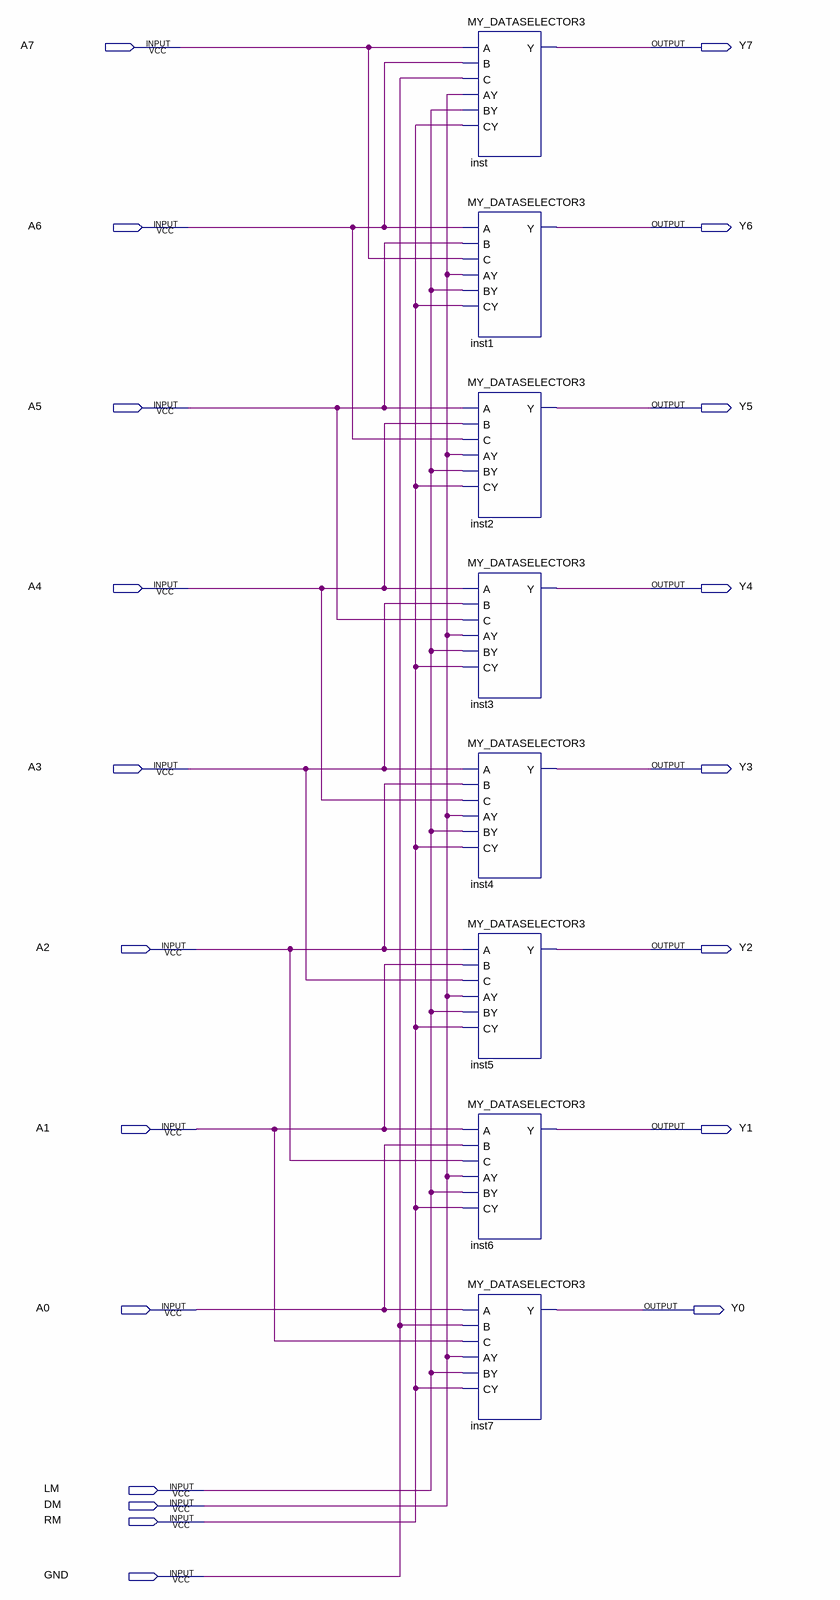
[diagram p0: schematic sheet]
// Quartus schematic MY_SHIFTER.bdf as structural Verilog: 8 symbols, 20 pins
module MY_SHIFTER (
  input  A7,
  input  A6,
  input  A5,
  input  A4,
  input  A3,
  input  A2,
  input  A1,
  input  A0,
  input  LM,
  input  DM,
  input  RM,
  input  GND,
  output Y7,
  output Y6,
  output Y5,
  output Y4,
  output Y3,
  output Y2,
  output Y1,
  output Y0
);

  MY_DATASELECTOR3 inst (.A(A7), .B(A6), .C(GND), .AY(DM), .BY(LM), .CY(RM), .Y(Y7));
  MY_DATASELECTOR3 inst1 (.A(A6), .B(A5), .C(A7), .AY(DM), .BY(LM), .CY(RM), .Y(Y6));
  MY_DATASELECTOR3 inst2 (.A(A5), .B(A4), .C(A6), .AY(DM), .BY(LM), .CY(RM), .Y(Y5));
  MY_DATASELECTOR3 inst3 (.A(A4), .B(A3), .C(A5), .AY(DM), .BY(LM), .CY(RM), .Y(Y4));
  MY_DATASELECTOR3 inst4 (.A(A3), .B(A2), .C(A4), .AY(DM), .BY(LM), .CY(RM), .Y(Y3));
  MY_DATASELECTOR3 inst5 (.A(A2), .B(A1), .C(A3), .AY(DM), .BY(LM), .CY(RM), .Y(Y2));
  MY_DATASELECTOR3 inst6 (.A(A1), .B(A0), .C(A2), .AY(DM), .BY(LM), .CY(RM), .Y(Y1));
  MY_DATASELECTOR3 inst7 (.A(A0), .B(GND), .C(A1), .AY(DM), .BY(LM), .CY(RM), .Y(Y0));
endmodule
